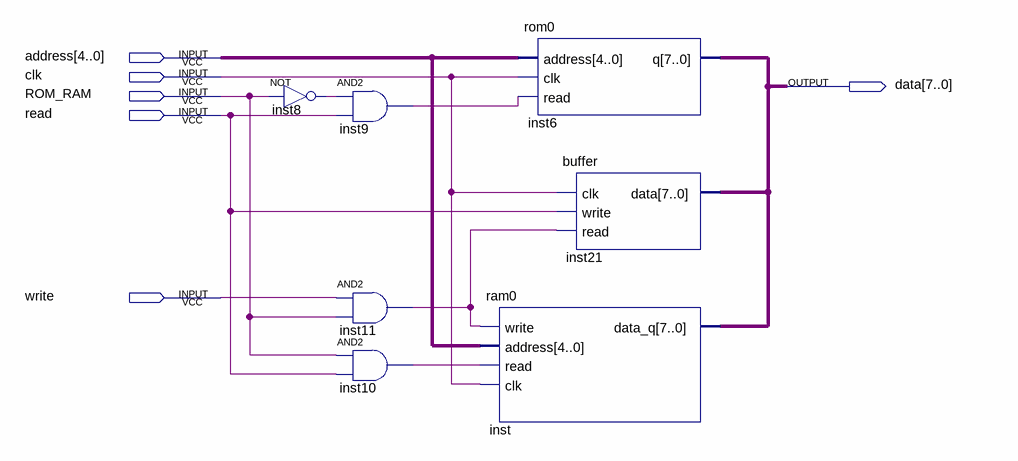
[diagram p0: schematic sheet]
// Quartus schematic Lab3.bdf as structural Verilog: 7 symbols, 6 pins
module Lab3 (
  input  [4:0] address,
  input  clk,
  input  ROM_RAM,
  input  read,
  input  write,
  output [7:0] data
);

  wire inst8_out, inst9_out, inst10_out, inst11_out;

  not inst8 (inst8_out, ROM_RAM);
  and inst9 (inst9_out, inst8_out, read);
  and inst11 (inst11_out, write, ROM_RAM);
  and inst10 (inst10_out, ROM_RAM, read);
  ram0 inst (.write(inst11_out), .address(address), .read(inst10_out), .clk(clk), .data_q(data));
  rom0 inst6 (.address(address), .clk(clk), .read(inst9_out), .q(data));
  buffer inst21 (.clk(clk), .write(read), .read(inst11_out), .data(data));
endmodule
